# EAGLE design WS2812 (EAGLE 6.3)
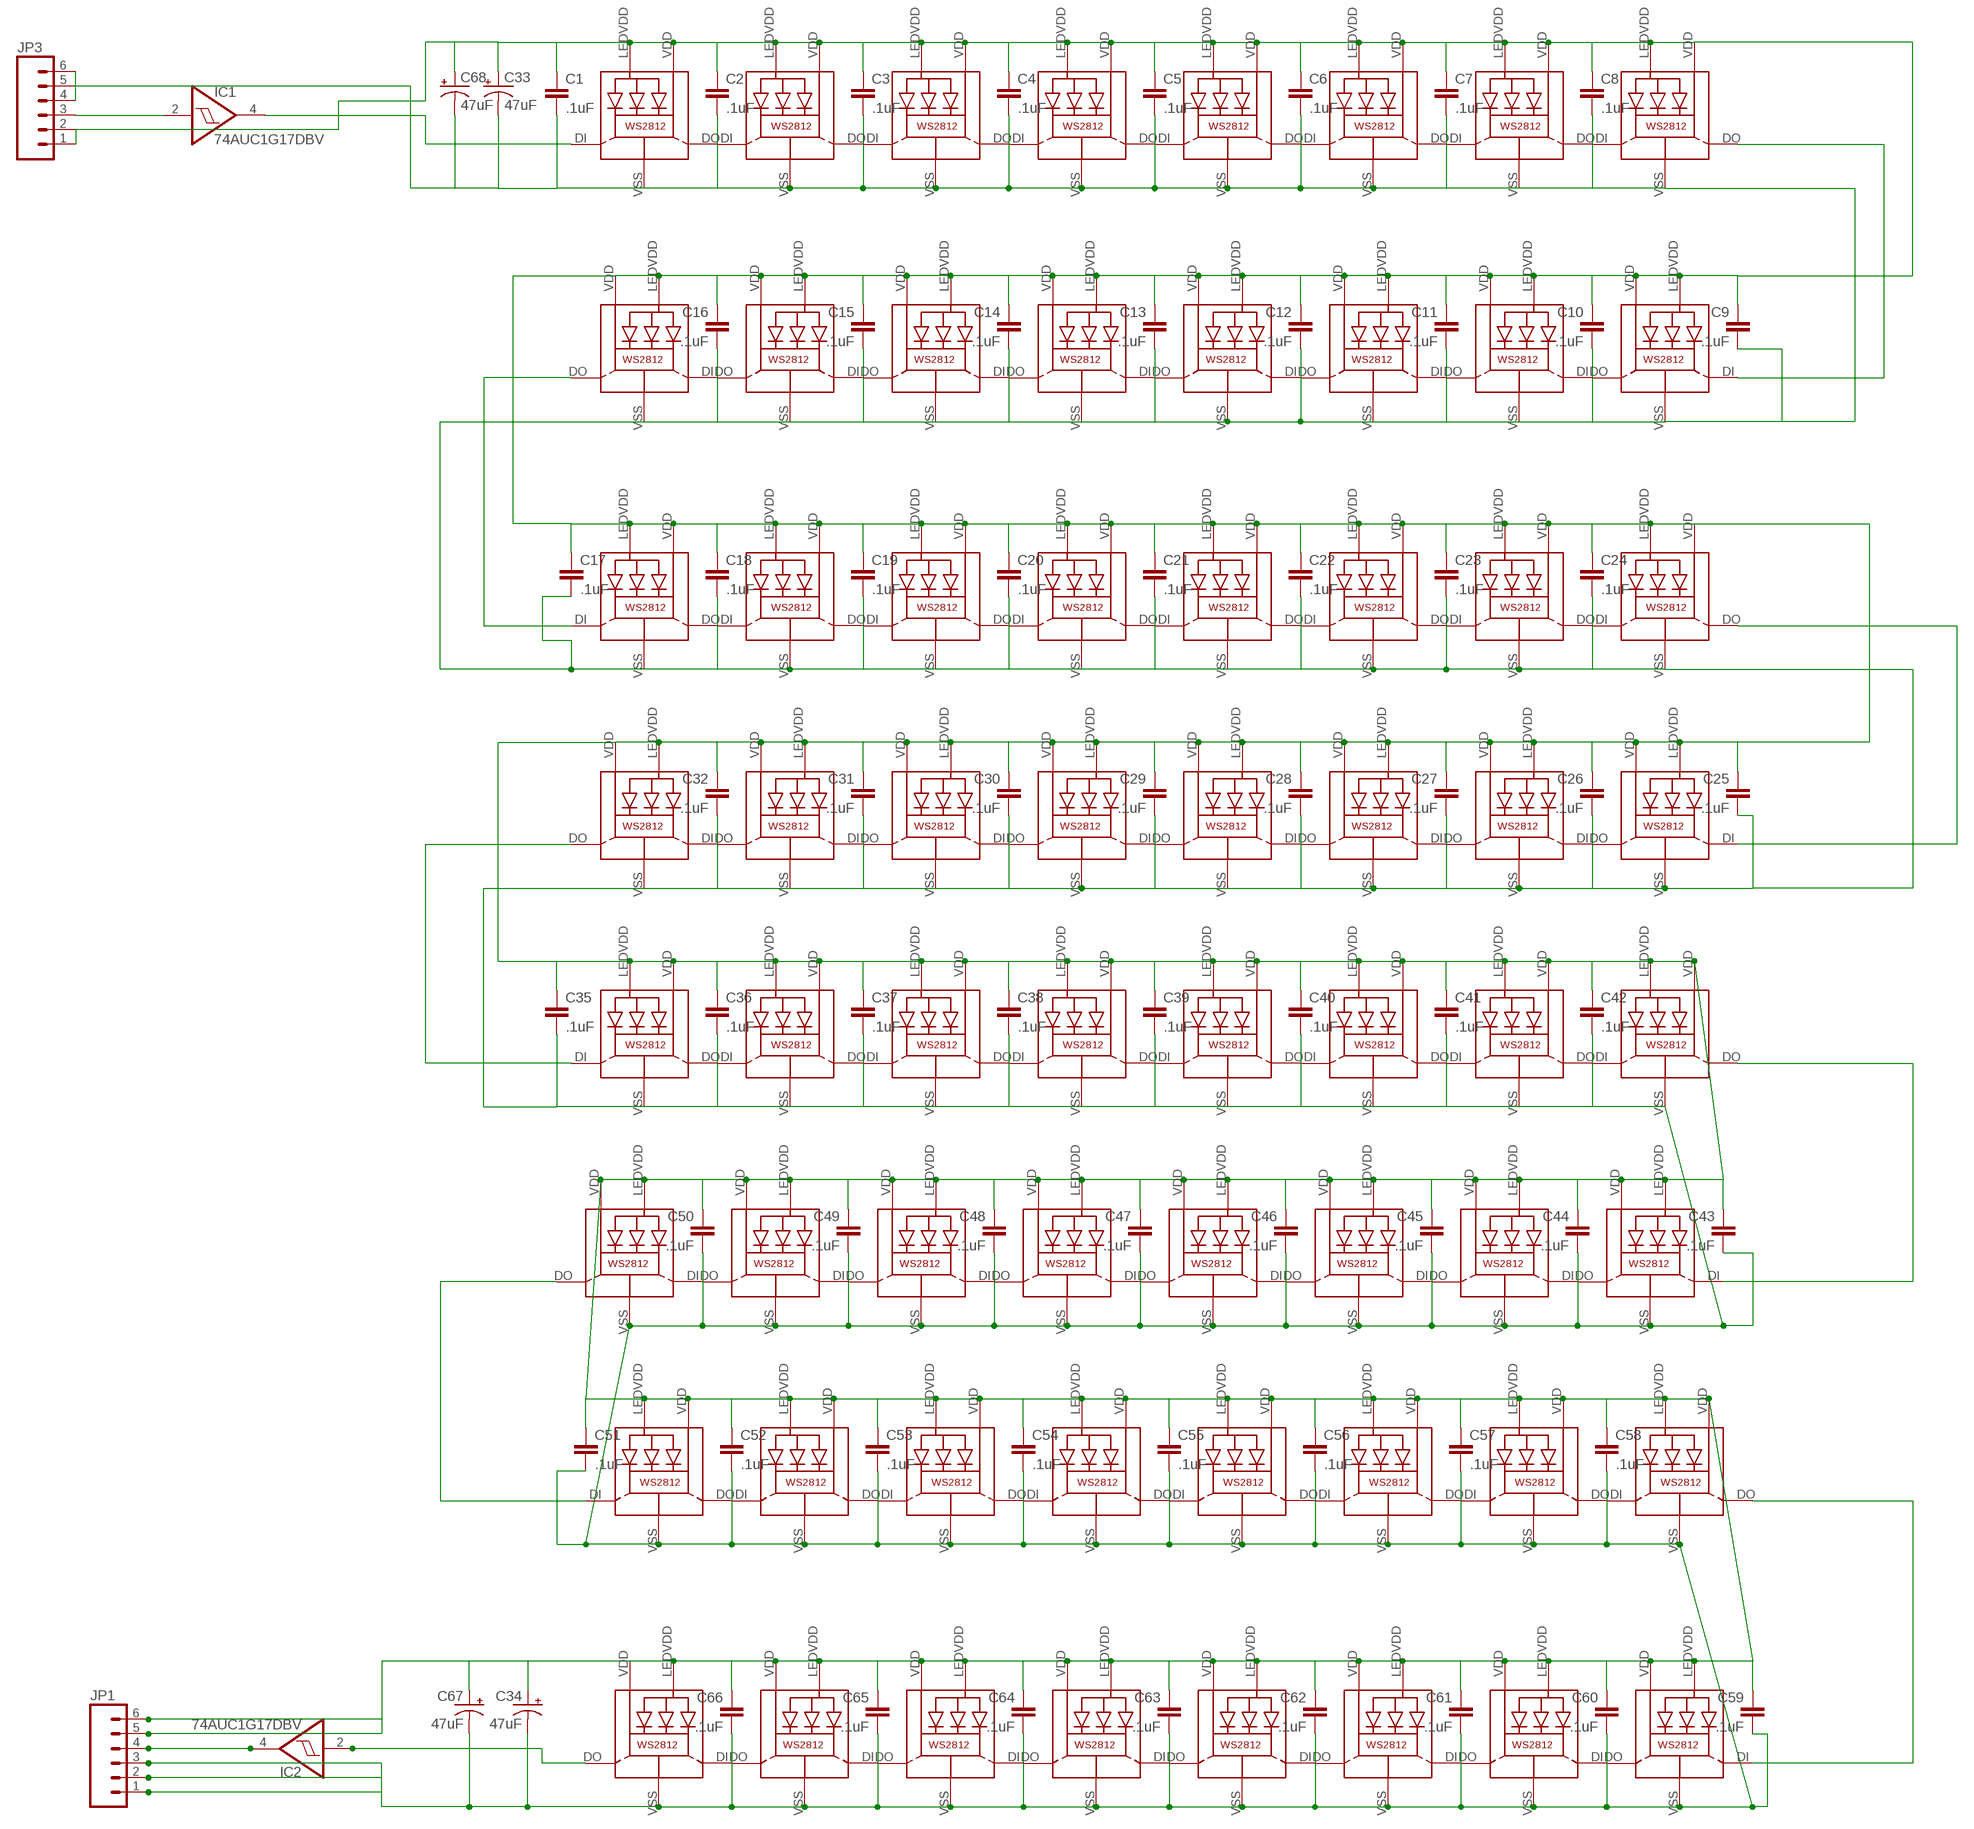
[diagram p0: schematic, sheet 1]

## Parts
C1  .1uF  CAP0603-CAP  [0603-CAP]
C2  .1uF  CAP0603-CAP  [0603-CAP]
C3  .1uF  CAP0603-CAP  [0603-CAP]
C4  .1uF  CAP0603-CAP  [0603-CAP]
C5  .1uF  CAP0603-CAP  [0603-CAP]
C6  .1uF  CAP0603-CAP  [0603-CAP]
C7  .1uF  CAP0603-CAP  [0603-CAP]
C8  .1uF  CAP0603-CAP  [0603-CAP]
C9  .1uF  CAP0603-CAP  [0603-CAP]
C10  .1uF  CAP0603-CAP  [0603-CAP]
C11  .1uF  CAP0603-CAP  [0603-CAP]
C12  .1uF  CAP0603-CAP  [0603-CAP]
C13  .1uF  CAP0603-CAP  [0603-CAP]
C14  .1uF  CAP0603-CAP  [0603-CAP]
C15  .1uF  CAP0603-CAP  [0603-CAP]
C16  .1uF  CAP0603-CAP  [0603-CAP]
C17  .1uF  CAP0603-CAP  [0603-CAP]
C18  .1uF  CAP0603-CAP  [0603-CAP]
C19  .1uF  CAP0603-CAP  [0603-CAP]
C20  .1uF  CAP0603-CAP  [0603-CAP]
C21  .1uF  CAP0603-CAP  [0603-CAP]
C22  .1uF  CAP0603-CAP  [0603-CAP]
C23  .1uF  CAP0603-CAP  [0603-CAP]
C24  .1uF  CAP0603-CAP  [0603-CAP]
C25  .1uF  CAP0603-CAP  [0603-CAP]
C26  .1uF  CAP0603-CAP  [0603-CAP]
C27  .1uF  CAP0603-CAP  [0603-CAP]
C28  .1uF  CAP0603-CAP  [0603-CAP]
C29  .1uF  CAP0603-CAP  [0603-CAP]
C30  .1uF  CAP0603-CAP  [0603-CAP]
C31  .1uF  CAP0603-CAP  [0603-CAP]
C32  .1uF  CAP0603-CAP  [0603-CAP]
C33  47uF  CAP_POL1206  [EIA3216]
C34  47uF  CAP_POL1206  [EIA3216]
C35  .1uF  CAP0603-CAP  [0603-CAP]
C36  .1uF  CAP0603-CAP  [0603-CAP]
C37  .1uF  CAP0603-CAP  [0603-CAP]
C38  .1uF  CAP0603-CAP  [0603-CAP]
C39  .1uF  CAP0603-CAP  [0603-CAP]
C40  .1uF  CAP0603-CAP  [0603-CAP]
C41  .1uF  CAP0603-CAP  [0603-CAP]
C42  .1uF  CAP0603-CAP  [0603-CAP]
C43  .1uF  CAP0603-CAP  [0603-CAP]
C44  .1uF  CAP0603-CAP  [0603-CAP]
C45  .1uF  CAP0603-CAP  [0603-CAP]
C46  .1uF  CAP0603-CAP  [0603-CAP]
C47  .1uF  CAP0603-CAP  [0603-CAP]
C48  .1uF  CAP0603-CAP  [0603-CAP]
C49  .1uF  CAP0603-CAP  [0603-CAP]
C50  .1uF  CAP0603-CAP  [0603-CAP]
C51  .1uF  CAP0603-CAP  [0603-CAP]
C52  .1uF  CAP0603-CAP  [0603-CAP]
C53  .1uF  CAP0603-CAP  [0603-CAP]
C54  .1uF  CAP0603-CAP  [0603-CAP]
C55  .1uF  CAP0603-CAP  [0603-CAP]
C56  .1uF  CAP0603-CAP  [0603-CAP]
C57  .1uF  CAP0603-CAP  [0603-CAP]
C58  .1uF  CAP0603-CAP  [0603-CAP]
C59  .1uF  CAP0603-CAP  [0603-CAP]
C60  .1uF  CAP0603-CAP  [0603-CAP]
C61  .1uF  CAP0603-CAP  [0603-CAP]
C62  .1uF  CAP0603-CAP  [0603-CAP]
C63  .1uF  CAP0603-CAP  [0603-CAP]
C64  .1uF  CAP0603-CAP  [0603-CAP]
C65  .1uF  CAP0603-CAP  [0603-CAP]
C66  .1uF  CAP0603-CAP  [0603-CAP]
C67  47uF  CAP_POL1206  [EIA3216]
C68  47uF  CAP_POL1206  [EIA3216]
IC1  74AUC1G17DBV  [SOT23-5]
IC2  74AUC1G17DBV  [SOT23-5]
JP1  M06SMD  [1X06-SMD]
JP3  M06SMD  [1X06-SMD]
LED1  WS2812  [WS2812]
LED2  WS2812  [WS2812]
LED3  WS2812  [WS2812]
LED4  WS2812  [WS2812]
LED5  WS2812  [WS2812]
LED6  WS2812  [WS2812]
LED7  WS2812  [WS2812]
LED8  WS2812  [WS2812]
LED9  WS2812  [WS2812]
LED10  WS2812  [WS2812]
LED11  WS2812  [WS2812]
LED12  WS2812  [WS2812]
LED13  WS2812  [WS2812]
LED14  WS2812  [WS2812]
LED15  WS2812  [WS2812]
LED16  WS2812  [WS2812]
LED17  WS2812  [WS2812]
LED18  WS2812  [WS2812]
LED19  WS2812  [WS2812]
LED20  WS2812  [WS2812]
LED21  WS2812  [WS2812]
LED22  WS2812  [WS2812]
LED23  WS2812  [WS2812]
LED24  WS2812  [WS2812]
LED25  WS2812  [WS2812]
LED26  WS2812  [WS2812]
LED27  WS2812  [WS2812]
LED28  WS2812  [WS2812]
LED29  WS2812  [WS2812]
LED30  WS2812  [WS2812]
LED31  WS2812  [WS2812]
LED32  WS2812  [WS2812]
LED33  WS2812  [WS2812]
LED34  WS2812  [WS2812]
LED35  WS2812  [WS2812]
LED36  WS2812  [WS2812]
LED37  WS2812  [WS2812]
LED38  WS2812  [WS2812]
LED39  WS2812  [WS2812]
LED40  WS2812  [WS2812]
LED41  WS2812  [WS2812]
LED42  WS2812  [WS2812]
LED43  WS2812  [WS2812]
LED44  WS2812  [WS2812]
LED45  WS2812  [WS2812]
LED46  WS2812  [WS2812]
LED47  WS2812  [WS2812]
LED48  WS2812  [WS2812]
LED49  WS2812  [WS2812]
LED50  WS2812  [WS2812]
LED51  WS2812  [WS2812]
LED52  WS2812  [WS2812]
LED53  WS2812  [WS2812]
LED54  WS2812  [WS2812]
LED55  WS2812  [WS2812]
LED56  WS2812  [WS2812]
LED57  WS2812  [WS2812]
LED58  WS2812  [WS2812]
LED59  WS2812  [WS2812]
LED60  WS2812  [WS2812]
LED61  WS2812  [WS2812]
LED62  WS2812  [WS2812]
LED63  WS2812  [WS2812]
LED64  WS2812  [WS2812]

## Nets
DIN: IC1.4(O) LED1.DI
DIN1: LED32.DO LED33.DI
DIN_B: IC1.2(I) JP3.3
DO: IC2.4(O) JP1.4
DO_B: IC2.2(I) LED64.DO
GND: C1.2 C2.2 C3.2 C4.2 C5.2 C6.2 C7.2 C8.2 C9.2 C10.2 C11.2 C12.2 C13.2 C14.2 C15.2 C16.2 C17.2 C18.2 C19.2 C20.2 C21.2 C22.2 C23.2 C24.2 C25.2 C26.2 C27.2 C28.2 C29.2 C30.2 C31.2 C32.2 C33.C(-) C34.C(-) C35.2 C36.2 C37.2 C38.2 C39.2 C40.2 C41.2 C42.2 C43.2 C44.2 C45.2 C46.2 C47.2 C48.2 C49.2 C50.2 C51.2 C52.2 C53.2 C54.2 C55.2 C56.2 C57.2 C58.2 C59.2 C60.2 C61.2 C62.2 C63.2 C64.2 C65.2 C66.2 C67.C(-) C68.C(-) JP1.1 JP1.2 JP1.3 JP3.4 JP3.5 JP3.6 LED1.VSS(GND) LED2.VSS(GND) LED3.VSS(GND) LED4.VSS(GND) LED5.VSS(GND) LED6.VSS(GND) LED7.VSS(GND) LED8.VSS(GND) LED9.VSS(GND) LED10.VSS(GND) LED11.VSS(GND) LED12.VSS(GND) LED13.VSS(GND) LED14.VSS(GND) LED15.VSS(GND) LED16.VSS(GND) LED17.VSS(GND) LED18.VSS(GND) LED19.VSS(GND) LED20.VSS(GND) LED21.VSS(GND) LED22.VSS(GND) LED23.VSS(GND) LED24.VSS(GND) LED25.VSS(GND) LED26.VSS(GND) LED27.VSS(GND) LED28.VSS(GND) LED29.VSS(GND) LED30.VSS(GND) LED31.VSS(GND) LED32.VSS(GND) LED33.VSS(GND) LED34.VSS(GND) LED35.VSS(GND) LED36.VSS(GND) LED37.VSS(GND) LED38.VSS(GND) LED39.VSS(GND) LED40.VSS(GND) LED41.VSS(GND) LED42.VSS(GND) LED43.VSS(GND) LED44.VSS(GND) LED45.VSS(GND) LED46.VSS(GND) LED47.VSS(GND) LED48.VSS(GND) LED49.VSS(GND) LED50.VSS(GND) LED51.VSS(GND) LED52.VSS(GND) LED53.VSS(GND) LED54.VSS(GND) LED55.VSS(GND) LED56.VSS(GND) LED57.VSS(GND) LED58.VSS(GND) LED59.VSS(GND) LED60.VSS(GND) LED61.VSS(GND) LED62.VSS(GND) LED63.VSS(GND) LED64.VSS(GND)
N$1: LED1.DO LED2.DI
N$2: LED2.DO LED3.DI
N$3: LED3.DO LED4.DI
N$4: LED5.DO LED6.DI
N$5: LED6.DO LED7.DI
N$6: LED7.DO LED8.DI
N$7: LED9.DO LED10.DI
N$8: LED10.DO LED11.DI
N$9: LED11.DO LED12.DI
N$10: LED13.DO LED14.DI
N$11: LED14.DO LED15.DI
N$12: LED15.DO LED16.DI
N$13: LED17.DO LED18.DI
N$14: LED18.DO LED19.DI
N$15: LED19.DO LED20.DI
N$16: LED21.DO LED22.DI
N$17: LED22.DO LED23.DI
N$18: LED23.DO LED24.DI
N$19: LED25.DO LED26.DI
N$20: LED26.DO LED27.DI
N$21: LED27.DO LED28.DI
N$22: LED29.DO LED30.DI
N$23: LED30.DO LED31.DI
N$24: LED31.DO LED32.DI
N$26: LED4.DO LED5.DI
N$27: LED16.DO LED17.DI
N$28: LED33.DO LED34.DI
N$29: LED34.DO LED35.DI
N$30: LED35.DO LED36.DI
N$31: LED37.DO LED38.DI
N$32: LED38.DO LED39.DI
N$33: LED39.DO LED40.DI
N$34: LED41.DO LED42.DI
N$35: LED42.DO LED43.DI
N$36: LED43.DO LED44.DI
N$37: LED45.DO LED46.DI
N$38: LED46.DO LED47.DI
N$39: LED47.DO LED48.DI
N$40: LED49.DO LED50.DI
N$41: LED50.DO LED51.DI
N$42: LED51.DO LED52.DI
N$43: LED53.DO LED54.DI
N$44: LED54.DO LED55.DI
N$45: LED55.DO LED56.DI
N$46: LED57.DO LED58.DI
N$47: LED58.DO LED59.DI
N$48: LED59.DO LED60.DI
N$49: LED61.DO LED62.DI
N$50: LED62.DO LED63.DI
N$51: LED63.DO LED64.DI
N$52: LED12.DO LED13.DI
N$53: LED20.DO LED21.DI
N$54: LED44.DO LED45.DI
N$55: LED52.DO LED53.DI
N$56: LED28.DO LED29.DI
N$57: LED8.DO LED9.DI
N$58: LED40.DO LED41.DI
N$59: LED24.DO LED25.DI
N$60: LED36.DO LED37.DI
N$61: LED60.DO LED61.DI
N$62: LED48.DO LED49.DI
N$63: LED56.DO LED57.DI
VDD: C1.1 C2.1 C3.1 C4.1 C5.1 C6.1 C7.1 C8.1 C9.1 C10.1 C11.1 C12.1 C13.1 C14.1 C15.1 C16.1 C17.1 C18.1 C19.1 C20.1 C21.1 C22.1 C23.1 C24.1 C25.1 C26.1 C27.1 C28.1 C29.1 C30.1 C31.1 C32.1 C33.A(+) C34.A(+) C35.1 C36.1 C37.1 C38.1 C39.1 C40.1 C41.1 C42.1 C43.1 C44.1 C45.1 C46.1 C47.1 C48.1 C49.1 C50.1 C51.1 C52.1 C53.1 C54.1 C55.1 C56.1 C57.1 C58.1 C59.1 C60.1 C61.1 C62.1 C63.1 C64.1 C65.1 C66.1 C67.A(+) C68.A(+) JP1.5 JP1.6 JP3.1 JP3.2 LED1.LEDVDD LED1.VDD LED2.LEDVDD LED2.VDD LED3.LEDVDD LED3.VDD LED4.LEDVDD LED4.VDD LED5.LEDVDD LED5.VDD LED6.LEDVDD LED6.VDD LED7.LEDVDD LED7.VDD LED8.LEDVDD LED8.VDD LED9.LEDVDD LED9.VDD LED10.LEDVDD LED10.VDD LED11.LEDVDD LED11.VDD LED12.LEDVDD LED12.VDD LED13.LEDVDD LED13.VDD LED14.LEDVDD LED14.VDD LED15.LEDVDD LED15.VDD LED16.LEDVDD LED16.VDD LED17.LEDVDD LED17.VDD LED18.LEDVDD LED18.VDD LED19.LEDVDD LED19.VDD LED20.LEDVDD LED20.VDD LED21.LEDVDD LED21.VDD LED22.LEDVDD LED22.VDD LED23.LEDVDD LED23.VDD LED24.LEDVDD LED24.VDD LED25.LEDVDD LED25.VDD LED26.LEDVDD LED26.VDD LED27.LEDVDD LED27.VDD LED28.LEDVDD LED28.VDD LED29.LEDVDD LED29.VDD LED30.LEDVDD LED30.VDD LED31.LEDVDD LED31.VDD LED32.LEDVDD LED32.VDD LED33.LEDVDD LED33.VDD LED34.LEDVDD LED34.VDD LED35.LEDVDD LED35.VDD LED36.LEDVDD LED36.VDD LED37.LEDVDD LED37.VDD LED38.LEDVDD LED38.VDD LED39.LEDVDD LED39.VDD LED40.LEDVDD LED40.VDD LED41.LEDVDD LED41.VDD LED42.LEDVDD LED42.VDD LED43.LEDVDD LED43.VDD LED44.LEDVDD LED44.VDD LED45.LEDVDD LED45.VDD LED46.LEDVDD LED46.VDD LED47.LEDVDD LED47.VDD LED48.LEDVDD LED48.VDD LED49.LEDVDD LED49.VDD LED50.LEDVDD LED50.VDD LED51.LEDVDD LED51.VDD LED52.LEDVDD LED52.VDD LED53.LEDVDD LED53.VDD LED54.LEDVDD LED54.VDD LED55.LEDVDD LED55.VDD LED56.LEDVDD LED56.VDD LED57.LEDVDD LED57.VDD LED58.LEDVDD LED58.VDD LED59.LEDVDD LED59.VDD LED60.LEDVDD LED60.VDD LED61.LEDVDD LED61.VDD LED62.LEDVDD LED62.VDD LED63.LEDVDD LED63.VDD LED64.LEDVDD LED64.VDD

## Power pins joined to a net without a drawn wire
GND: IC1.3(GND) IC2.3(GND)
VDD: IC1.5(VCC) IC2.5(VCC)

## Library data of the parts
C1-C32 C35-C66 = 1x05smd:CAP: Capacitor Standard 0603 ceramic capacitor, and 0.1" leaded capacitor.
C33 C34 C67 C68 = SparkFun-Capacitors:CAP_POL: Capacitor Polarized These are standard SMD and PTH capacitors. Normally 10uF, 47uF, and 100uF in electrolytic and tantalum varieties. Always verify the external diameter of the through hole cap, it varies with capacity, voltage, and manufacturer. The EIA devices should be standard.
IC1 IC2 = 74xx-little-de:74*1G17: Single Schmitt-Trigger Buffer
JP1 JP3 = 1x05smd:M06: Header 6 Standard 6-pin 0.1" header. Use with straight break away headers (SKU : PRT-00116), right angle break away headers (PRT-00553), swiss pins (PRT-00743), machine pins (PRT-00117), and female headers (PRT-00115). Molex polarized connector foot print use with SKU : PRT-08094 with associated crimp pins and housings. NOTES ON THE VARIANTS LOCK and LOCK_LONGPADS... This footprint was designed to help hold the alignment of a through-hole component (i.e. 6-pin header) while soldering it into place. You may notice that each hole has been shifted either up or down by 0.005 of an inch from it's more standard position (which is a perfectly straight line). This slight alteration caused the pins (the squares in the middle) to touch the edges of the holes. Because they are alternating, it causes a "brace" to hold the component in place. 0.005 has proven to be the perfect amount of "off-center" position when using our standard breakaway headers. Although looks a little odd when you look at the bare footprint, once you have a header in there, the alteration is very hard to notice. Also, if you push a header all the way into place, it is covered up entirely on the bottom side. This idea of altering the position of holes to aid alignment will be further integrated into the Sparkfun Library for other footprints. It can help hold any component with 3 or more connection pins.
LED1-LED64 = adafruit:WS2812

## Board
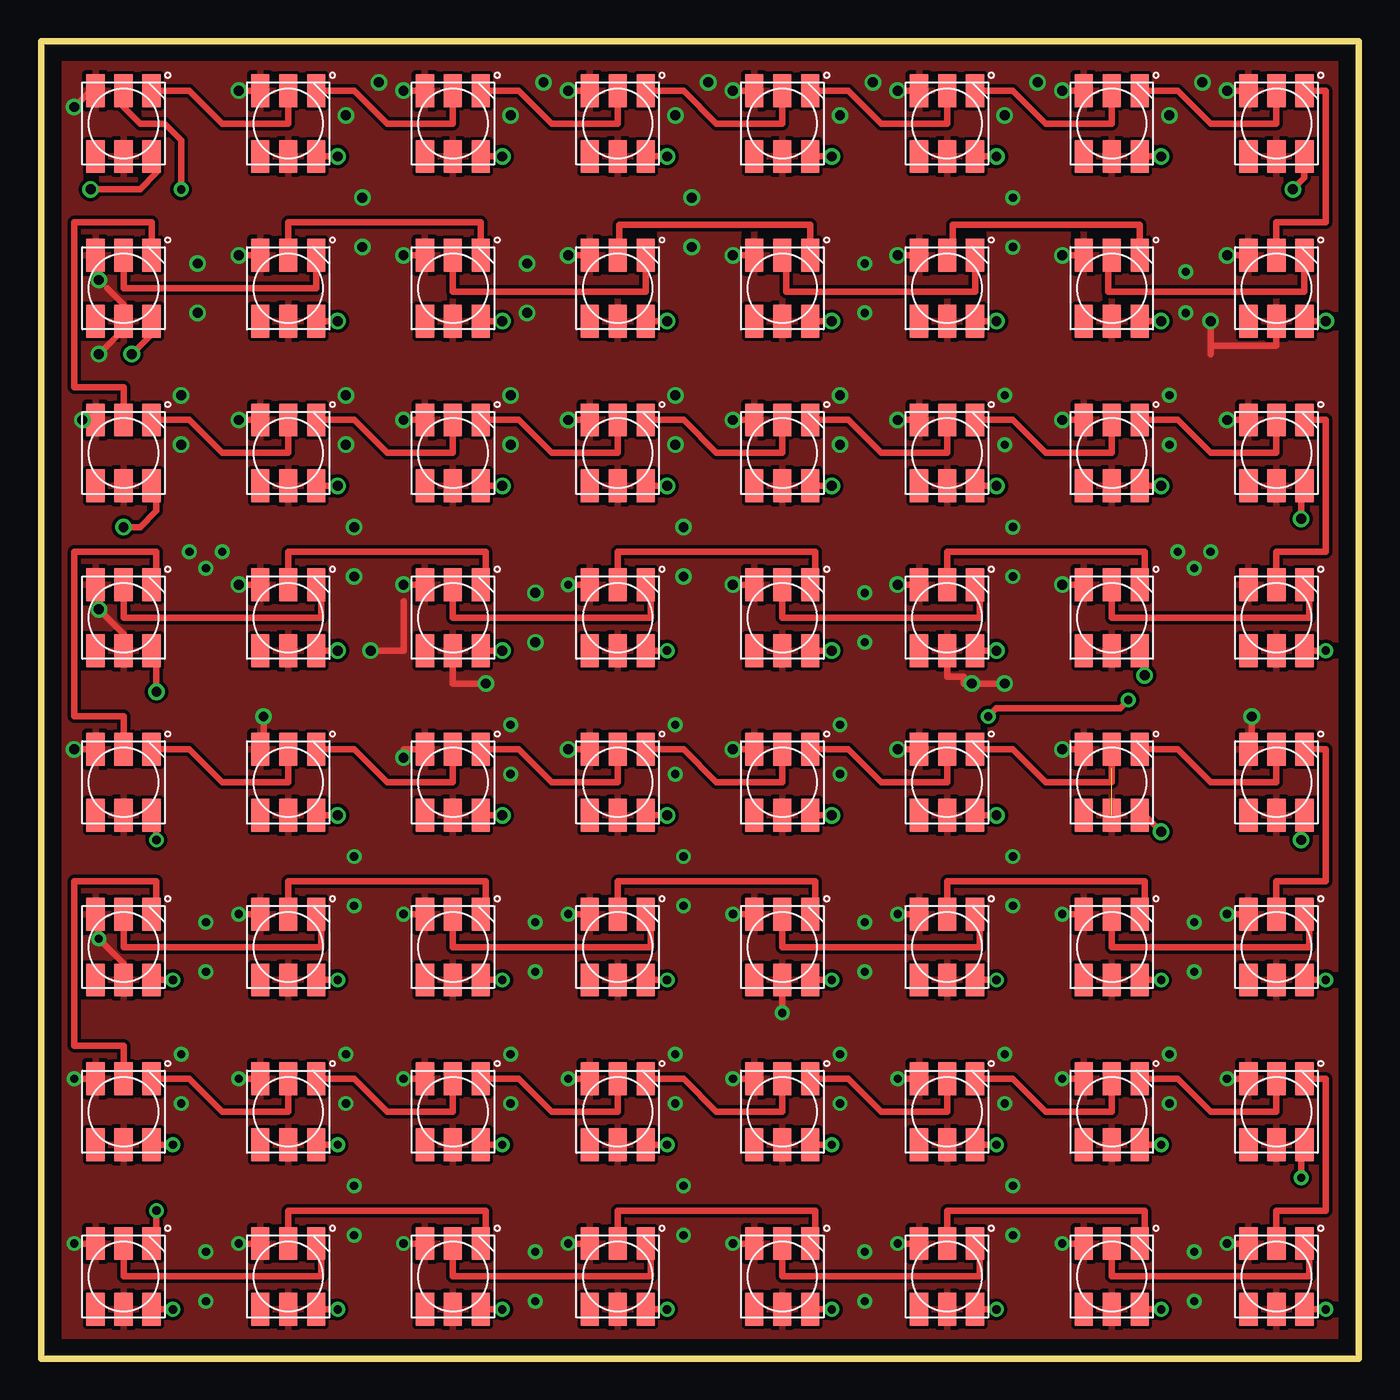
[diagram p1: board, top side]
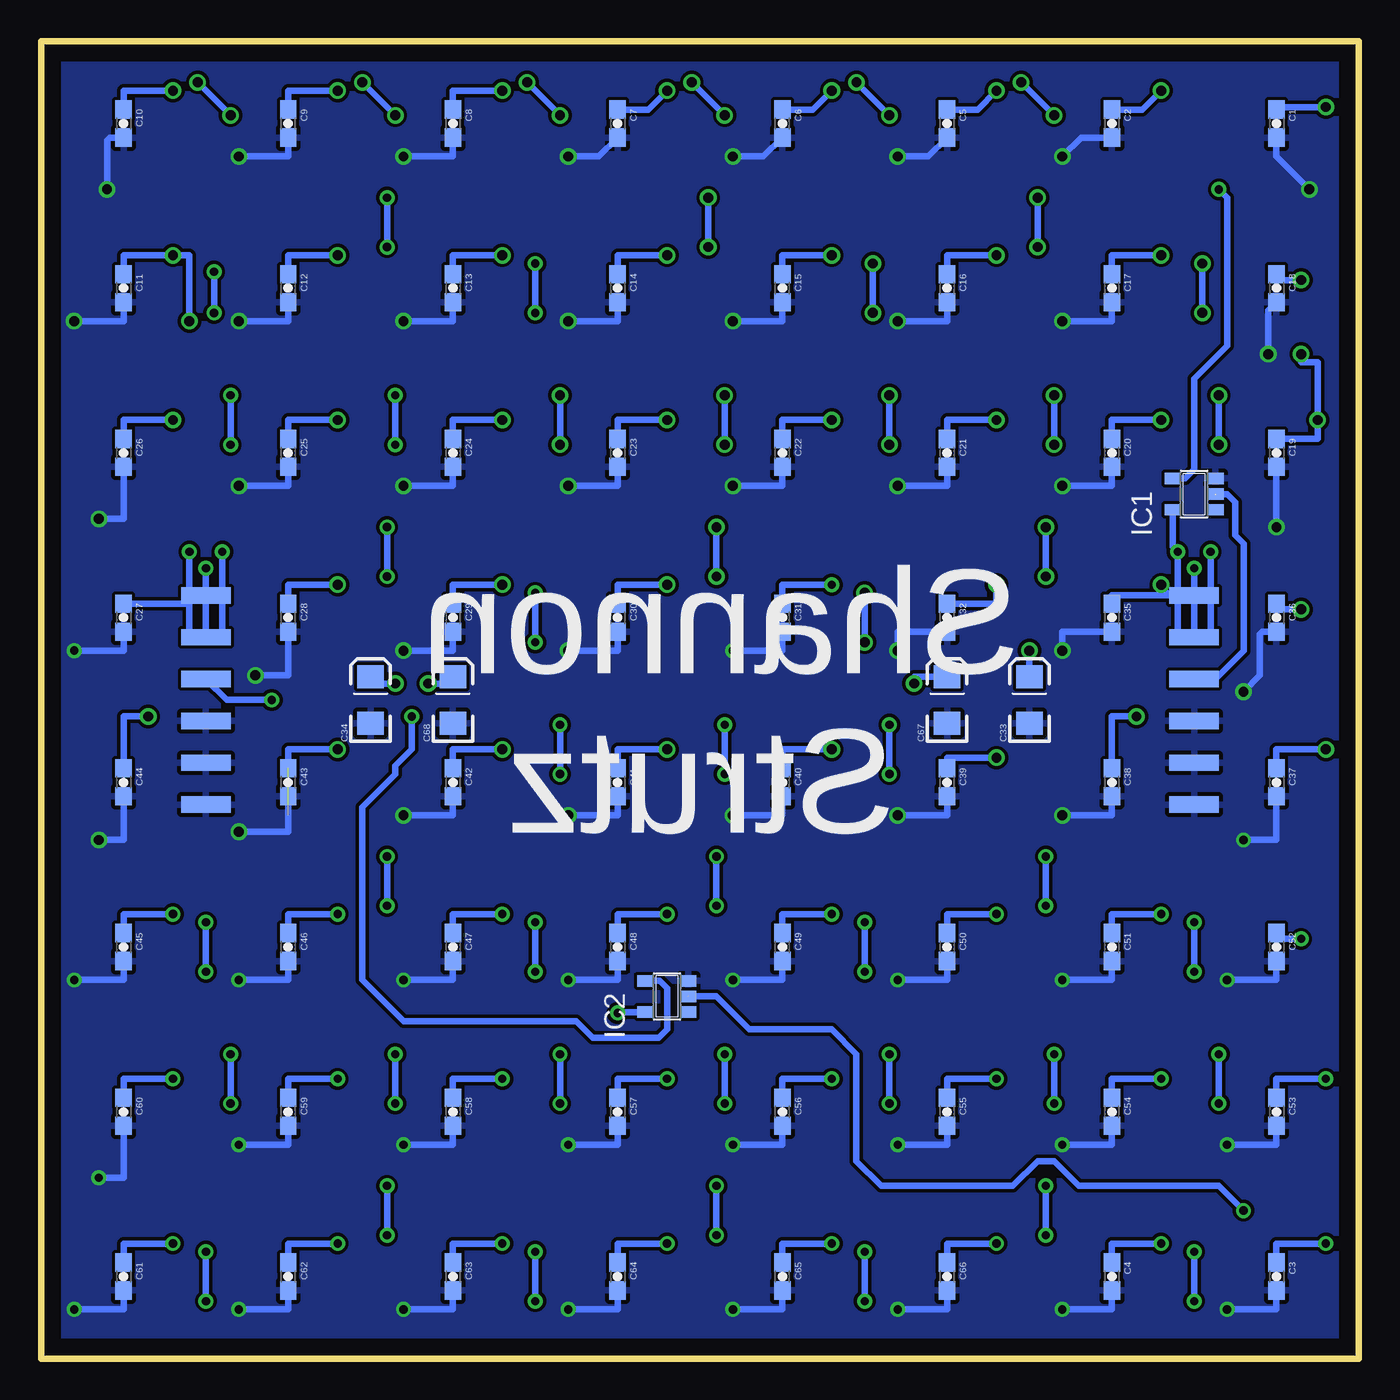
[diagram p2: board, bottom side, seen from below]

Size 80 x 80 mm. Coordinates in mm from the lower left corner, seen from the top.
Outline: 0,0 80,0 80,80 0,80 0,0
Copper layers (1*16): Top 0.035mm / dielectric 1.5mm / Bottom 0.035mm
Design rules "default": minimum track width 10mil, minimum drill 24mil, track to track 8mil, track to pad 8mil, pad to pad 8mil, via to via 8mil, smd to smd 8mil, copper to edge 40mil, drill to drill 8mil, minimum pad ring 10mil, minimum via ring 8mil, stop-mask expansion 4mil, vias tented up to drill 0mil, thermal gap 10mil

### Footprints (pad centres in the part's own frame; a part is rotated, then mirrored left to right if it is on the bottom)
0603-CAP = smd 1.1 x 1: 1 -0.85,0; 2 0.85,0
EIA3216 = smd 1.4 x 1.6: A 1.4,0; C -1.4,0
SOT23-5 = smd 0.69 x 0.99: 1 -0.95,-1.29; 2 0,-1.29; 3 0.95,-1.29; 4 0.95,1.3; 5 -0.95,1.3
1X06-SMD = smd 1 x 3: 1 -6.35,5; 2 -3.81,5; 3 -1.27,5; 4 1.27,5; 5 3.81,5; 6 6.35,5
WS2812 = smd 2 x 1.1: DI 2,0; DO 2,-1.7; LEDVDD -2,0; NC -2,1.7; VDD 2,1.7; VSS -2,-1.7

### Placement (x,y rotation side)
C1  5,75 270 bottom
C2  15,75 270 bottom
C3  5,5 270 bottom
C4  15,5 270 bottom
C5  25,75 270 bottom
C6  35,75 270 bottom
C7  45,75 270 bottom
C8  55,75 270 bottom
C9  65,75 270 bottom
C10  75,75 270 bottom
C11  75,65 270 bottom
C12  65,65 270 bottom
C13  55,65 270 bottom
C14  45,65 270 bottom
C15  35,65 270 bottom
C16  25,65 270 bottom
C17  15,65 270 bottom
C18  5,65 270 bottom
C19  5,55 270 bottom
C20  15,55 270 bottom
C21  25,55 270 bottom
C22  35,55 270 bottom
C23  45,55 270 bottom
C24  55,55 270 bottom
C25  65,55 270 bottom
C26  75,55 270 bottom
C27  75,45 270 bottom
C28  65,45 270 bottom
C29  55,45 270 bottom
C30  45,45 270 bottom
C31  35,45 270 bottom
C32  25,45 270 bottom
C33  20,40 90 bottom
C34  60,40 90 bottom
C35  15,45 270 bottom
C36  5,45 270 bottom
C37  5,35 270 bottom
C38  15,35 270 bottom
C39  25,35 270 bottom
C40  35,35 270 bottom
C41  45,35 270 bottom
C42  55,35 270 bottom
C43  65,35 270 bottom
C44  75,35 270 bottom
C45  75,25 270 bottom
C46  65,25 270 bottom
C47  55,25 270 bottom
C48  45,25 270 bottom
C49  35,25 270 bottom
C50  25,25 270 bottom
C51  15,25 270 bottom
C52  5,25 270 bottom
C53  5,15 270 bottom
C54  15,15 270 bottom
C55  25,15 270 bottom
C56  35,15 270 bottom
C57  45,15 270 bottom
C58  55,15 270 bottom
C59  65,15 270 bottom
C60  75,15 270 bottom
C61  75,5 270 bottom
C62  65,5 270 bottom
C63  55,5 270 bottom
C64  45,5 270 bottom
C65  35,5 270 bottom
C66  25,5 270 bottom
C67  25,40 90 bottom
C68  55,40 90 bottom
IC1  10,52.5 90 bottom
IC2  42,22 90 bottom
JP1  65,40 90 bottom
JP3  15,40 270 bottom
LED1  5,75 90 top
LED2  15,75 90 top
LED3  25,75 90 top
LED4  35,75 90 top
LED5  45,75 90 top
LED6  55,75 90 top
LED7  65,75 90 top
LED8  75,75 90 top
LED9  75,65 90 top
LED10  65,65 90 top
LED11  55,65 90 top
LED12  45,65 90 top
LED13  35,65 90 top
LED14  25,65 90 top
LED15  15,65 90 top
LED16  5,65 90 top
LED17  5,55 90 top
LED18  15,55 90 top
LED19  25,55 90 top
LED20  35,55 90 top
LED21  45,55 90 top
LED22  55,55 90 top
LED23  65,55 90 top
LED24  75,55 90 top
LED25  75,45 90 top
LED26  65,45 90 top
LED27  55,45 90 top
LED28  45,45 90 top
LED29  35,45 90 top
LED30  25,45 90 top
LED31  15,45 90 top
LED32  5,45 90 top
LED33  5,35 90 top
LED34  15,35 90 top
LED35  25,35 90 top
LED36  35,35 90 top
LED37  45,35 90 top
LED38  55,35 90 top
LED39  65,35 90 top
LED40  75,35 90 top
LED41  75,25 90 top
LED42  65,25 90 top
LED43  55,25 90 top
LED44  45,25 90 top
LED45  35,25 90 top
LED46  25,25 90 top
LED47  15,25 90 top
LED48  5,25 90 top
LED49  5,15 90 top
LED50  15,15 90 top
LED51  25,15 90 top
LED52  35,15 90 top
LED53  45,15 90 top
LED54  55,15 90 top
LED55  65,15 90 top
LED56  75,15 90 top
LED57  75,5 90 top
LED58  65,5 90 top
LED59  55,5 90 top
LED60  45,5 90 top
LED61  35,5 90 top
LED62  25,5 90 top
LED63  15,5 90 top
LED64  5,5 90 top

### Tracks (layer width: path | path; a pad name or v marks a point on that pad's centre or on a via)
DIN  (via drill 0.5 pad 0.25)
  Top 0.406: v8.5,71 8.5,74 7.5,75 6,75 5,76 LED1.DI
  Bottom 0.406: IC1.4 10.55,53.45 10,54 10,59.5 8,61.5 8,70.5 v8.5,71
DIN1
  Top 0.406: LED32.DO 7,47 7,49 2,49 2,39 5,39 LED33.DI
DIN_B
  Bottom 0.406: JP3.3 8.73,41.27 7,43 7,49.5 7.5,50 7.5,52 8,52.5 IC1.2
DO  (via drill 0.5 pad 0.25)
  Top 0.406: v57.5,39 58,39.5 65.5,39.5 v66,40
  Bottom 0.406: IC2.4 42.45,22.95 42,22.5 42,20 42.5,19.5 46.5,19.5 47.5,20.5 58,20.5 60.5,23 60.5,33.5 58.5,35.5 58.5,36 57.5,37 v57.5,39 | v66,40 68.73,40 JP1.4
DO_B  (via drill 0.5 pad 0.25)
  Top 0.406: v7,9 7,7.3 LED64.DO
  Bottom 0.406: IC2.2 39,22 37,20 32,20 30.5,18.5 30.5,12 29,10.5 21,10.5 19.5,12 18.5,12 17,10.5 8.5,10.5 v7,9
GND  (via drill 0.5 pad 0.25, 0.6)
  Top 0.406: v28,43 LED30.VSS | v18,43 LED31.VSS | v3,71 6,71 7,72 7,72.7 LED1.VSS | v18,73 LED2.VSS | LED3.VSS v28,73 | LED4.VSS v38,73 | LED5.VSS v48,73 | LED6.VSS v58,73 | LED7.VSS v68,73 | LED8.VSS 76.7,71.7 v76,71 | LED16.VSS 6.7,62.2 v5.5,61 | LED15.VSS v18,63 | LED14.VSS v28,63 | LED13.VSS v38,63 | LED12.VSS v48,63 | LED11.VSS v58,63 | LED10.VSS v68,63 | LED9.VSS v78,63 | LED24.VSS 76.5,53 v76.5,51 | LED23.VSS v68,53 | LED22.VSS v58,53 | LED21.VSS v48,53 | LED20.VSS v38,53 | LED19.VSS v28,53 | LED18.VSS v18,53 | v5,50.5 6,50.5 7,51.5 7,52.7 LED17.VSS | v7,40.5 7,42.7 LED32.VSS | LED34.VSS v18,33 | LED35.VSS v28,33 | LED36.VSS v38,33 | LED37.VSS v48,33 | LED38.VSS v58,33 | LED39.VSS 67,33 v68,32 | LED40.VSS 76.5,33 v76.5,31.5 | LED28.VSS v48,43 | LED27.VSS v58,43 | LED26.VSS 67,43 v67,41.5 | LED29.VSS v38,43 | LED25.VSS v78,43 | LED33.VSS 7,33 v7,31.5 | LED46.VSS v28,23 | LED47.VSS v18,23 | LED48.VSS v8,23 | LED45.VSS v38,23 | LED44.VSS v48,23 | LED43.VSS v58,23 | LED42.VSS v68,23 | LED41.VSS v78,23 | LED49.VSS v8,13 | LED50.VSS v18,13 | LED51.VSS v28,13 | LED52.VSS v38,13 | LED53.VSS v48,13 | LED54.VSS v58,13 | LED55.VSS v68,13 | LED56.VSS 76.5,13 v76.5,11 | LED64.VSS v8,3 | LED63.VSS v18,3 | LED62.VSS v28,3 | LED61.VSS v38,3 | LED59.VSS v58,3 | LED58.VSS v68,3 | LED57.VSS v78,3 | LED60.VSS v48,3
  Bottom 0.406: C32.2 28,44.15 v28,43 | C35.2 18,44.15 v18,43 | C1.2 5,73 v3,71 | C2.2 16.85,74.15 v18,73 | v28,73 26.15,73 C5.2 | v38,73 36.15,73 C6.2 | v48,73 46.15,73 C7.2 | v58,73 55,73 C8.2 | v68,73 65,73 C9.2 | v76,71 76,74 75.85,74.15 C10.2 | v5.5,61 5.5,63.65 C18.2 | v18,63 15,63 C17.2 | v28,63 25,63 C16.2 | v38,63 35,63 C15.2 | v48,63 45,63 C14.2 | v58,63 55,63 C13.2 | v68,63 65,63 C12.2 | v78,63 75,63 C11.2 | v76.5,51 75,51 C26.2 | v68,53 65,53 C25.2 | v58,53 55,53 C24.2 | v48,53 45,53 C23.2 | v38,53 35,53 C22.2 | v28,53 25,53 C21.2 | v18,53 15,53 C20.2 | C19.2 v5,50.5 | C36.2 5.85,44.15 6,44 6,41.5 v7,40.5 | v18,33 15,33 C38.2 | v28,33 25,33 C39.2 | v38,33 35,33 C40.2 | v48,33 45,33 C41.2 | v58,33 55,33 C42.2 | v68,32 65,32 C43.2 | v76.5,31.5 75,31.5 C44.2 | v48,43 45,43 C30.2 | v58,43 55,43 C29.2 | v67,41.5 65,41.5 C28.2 | v38,43 35,43 C31.2 | v78,43 75,43 C27.2 | v7,31.5 5,31.5 C37.2 | v28,23 25,23 C50.2 | v18,23 15,23 C51.2 | v8,23 5,23 C52.2 | v38,23 35,23 C49.2 | v48,23 45,23 C48.2 | v58,23 55,23 C47.2 | v68,23 65,23 C46.2 | v78,23 75,23 C45.2 | v8,13 5,13 C53.2 | v18,13 15,13 C54.2 | v28,13 25,13 C55.2 | v38,13 35,13 C56.2 | v48,13 45,13 C57.2 | v58,13 55,13 C58.2 | v68,13 65,13 C59.2 | v76.5,11 75,11 C60.2 | v8,3 5,3 C3.2 | v18,3 15,3 C4.2 | v28,3 25,3 C66.2 | v38,3 35,3 C65.2 | v58,3 55,3 C63.2 | v68,3 65,3 C62.2 | v78,3 75,3 C61.2 | v48,3 45,3 C64.2
  pour Bottom: 0,0 80,0 80,80 0,80
N$1
  Top 0.406: LED1.DO 9,77 11,75 15,75 LED2.DI
N$2
  Top 0.406: LED2.DO 19,77 21,75 25,75 LED3.DI
N$3
  Top 0.406: LED3.DO 29,77 31,75 35,75 LED4.DI
N$4
  Top 0.406: LED5.DO 49,77 51,75 55,75 LED6.DI
N$5
  Top 0.406: LED6.DO 59,77 61,75 65,75 LED7.DI
N$6
  Top 0.406: LED7.DO 69,77 71,75 75,75 LED8.DI
N$7
  Top 0.406: LED9.DO 76.7,64.8 64.8,64.8 64.8,67 LED10.DI
N$8
  Top 0.406: LED10.DO 66.7,68.85 55.35,68.85 55.35,67 LED11.DI
N$9
  Top 0.406: LED11.DO 56.7,64.8 45.23,64.8 45.23,67 LED12.DI
N$10
  Top 0.406: LED13.DO 36.7,64.8 24.98,64.8 24.98,67 LED14.DI
N$11
  Top 0.406: LED14.DO 26.7,69 15,69 LED15.DI
N$12
  Top 0.406: LED15.DO 16.7,65 5,65 LED16.DI
N$13
  Top 0.406: LED17.DO 9,57 11,55 15,55 LED18.DI
N$14
  Top 0.406: LED18.DO 19,57 21,55 25,55 LED19.DI
N$15
  Top 0.406: LED19.DO 29,57 31,55 35,55 LED20.DI
N$16
  Top 0.406: LED21.DO 49,57 51,55 55,55 LED22.DI
N$17
  Top 0.406: LED22.DO 59,57 61,55 65,55 LED23.DI
N$18
  Top 0.406: LED23.DO 69,57 71,55 75,55 LED24.DI
N$19
  Top 0.406: LED25.DO 77,47 77,45 65,45 LED26.DI
N$20
  Top 0.406: LED26.DO 67,47 67,49 55,49 LED27.DI
N$21
  Top 0.406: LED27.DO 57,47 57,45 45,45 LED28.DI
N$22
  Top 0.406: LED29.DO 37,47 37,45 25,45 LED30.DI
N$23
  Top 0.406: LED30.DO 27,47 27,49 15,49 LED31.DI
N$24
  Top 0.406: LED31.DO 17,47 17,45 5,45 LED32.DI
N$26
  Top 0.406: LED4.DO 39,77 41,75 45,75 LED5.DI
N$27
  Top 0.406: LED16.DO 6.7,69 2,69 2,59 5,59 LED17.DI
N$28
  Top 0.406: LED33.DO 9,37 11,35 15,35 LED34.DI
N$29
  Top 0.406: LED34.DO 19,37 21,35 25,35 LED35.DI
N$30
  Top 0.406: LED35.DO 29,37 31,35 35,35 LED36.DI
N$31
  Top 0.406: LED37.DO 49,37 51,35 55,35 LED38.DI
N$32
  Top 0.406: LED38.DO 59,37 61,35 65,35 LED39.DI
N$33
  Top 0.406: LED39.DO 69,37 71,35 75,35 LED40.DI
N$34
  Top 0.406: LED41.DO 77,27 77,25 65,25 LED42.DI
N$35
  Top 0.406: LED42.DO 67,27 67,29 55,29 LED43.DI
N$36
  Top 0.406: LED43.DO 57,27 57,25 45,25 LED44.DI
N$37
  Top 0.406: LED45.DO 37,27 37,25 25,25 LED46.DI
N$38
  Top 0.406: LED46.DO 27,27 27,29 15,29 LED47.DI
N$39
  Top 0.406: LED47.DO 17,27 17,25 5,25 LED48.DI
N$40
  Top 0.406: LED49.DO 9,17 11,15 15,15 LED50.DI
N$41
  Top 0.406: LED50.DO 19,17 21,15 25,15 LED51.DI
N$42
  Top 0.406: LED51.DO 29,17 31,15 35,15 LED52.DI
N$43
  Top 0.406: LED53.DO 49,17 51,15 55,15 LED54.DI
N$44
  Top 0.406: LED54.DO 59,17 61,15 65,15 LED55.DI
N$45
  Top 0.406: LED55.DO 69,17 71,15 75,15 LED56.DI
N$46
  Top 0.406: LED57.DO 77,7 77,5 65,5 LED58.DI
N$47
  Top 0.406: LED58.DO 67,7 67,9 55,9 LED59.DI
N$48
  Top 0.406: LED59.DO 57,7 57,5 45,5 LED60.DI
N$49
  Top 0.406: LED61.DO 37,7 37,5 25,5 LED62.DI
N$50
  Top 0.406: LED62.DO 27,7 27,9 15,9 LED63.DI
N$51
  Top 0.406: LED63.DO 17,7 17,5 5,5 LED64.DI
N$52
  Top 0.406: LED12.DO 46.7,68.85 35.1,68.85 35.1,67 LED13.DI
N$53
  Top 0.406: LED20.DO 39,57 41,55 45,55 LED21.DI
N$54
  Top 0.406: LED44.DO 47,27 47,29 35,29 LED45.DI
N$55
  Top 0.406: LED52.DO 39,17 41,15 45,15 LED53.DI
N$56
  Top 0.406: LED28.DO 47,47 47,49 35,49 LED29.DI
N$57
  Top 0.406: LED8.DO 78,77 78,69 75,69 LED9.DI
N$58
  Top 0.406: LED40.DO 78,37 78,29 75,29 LED41.DI
N$59
  Top 0.406: LED24.DO 78,57 78,49 75,49 LED25.DI
N$60
  Top 0.406: LED36.DO 39,37 41,35 45,35 LED37.DI
N$61
  Top 0.406: LED60.DO 47,7 47,9 35,9 LED61.DI
N$62
  Top 0.406: LED48.DO 7,27 7,29 2,29 2,19 5,19 LED49.DI
N$63
  Top 0.406: LED56.DO 78,17 78,9 75,9 LED57.DI
VDD  (via drill 0.5 pad 0.25, 0.6)  (1 unrouted)
  Top 0.406: v22,47 LED30.VDD | v20,43 22,43 22,46 | v27,41 25,41 LED30.LEDVDD | LED1.VDD 3,77 v2,76 | v12,77 LED2.VDD | v22,77 LED3.VDD | v32,77 LED4.VDD | v42,77 LED5.VDD | LED6.VDD v52,77 | LED7.VDD v62,77 | LED8.VDD v72,77 | LED16.VDD 3.3,65.7 v3.5,65.5 | 4,65 5,64 LED16.LEDVDD 5,62.5 v3.5,61 | v2.5,57 LED17.VDD | LED15.VDD v12,67 | LED14.VDD v22,67 | LED13.VDD v32,67 | LED12.VDD v42,67 | LED11.VDD v52,67 | LED10.VDD v62,67 | LED9.VDD v72,67 | LED9.LEDVDD 75,61.5 71,61.5 | 71,61.5 71,61 | 71,61.5 v71,63 | LED24.VDD v72,57 | LED23.VDD v62,57 | LED22.VDD v52,57 | LED21.VDD v42,57 | LED20.VDD v32,57 | LED19.VDD v22,57 | LED18.VDD v12,57 | LED32.VDD 3.3,45.7 v3.5,45.5 5,44 LED32.LEDVDD | LED31.VDD v12,47 | LED33.VDD v2,37 | LED34.VDD 13.5,37 v13.5,39 | LED35.VDD 22,37 v22,36.5 | LED36.VDD v32,37 | LED37.VDD v42,37 | LED38.VDD v52,37 | LED39.VDD v62,37 | LED40.VDD 73.5,37 v73.5,39 | LED27.LEDVDD C68.A 56,41.4 56,41 v56.5,41 v58.5,41 | LED28.VDD v42,47 | LED27.VDD v52,47 | LED26.VDD v62,47 | LED29.VDD v32,47 | LED46.VDD v22,27 | LED47.VDD v12,27 | LED48.VDD 3.5,27 v3.5,25.5 5,24 LED48.LEDVDD | LED45.VDD v32,27 | LED44.VDD v42,27 | LED43.VDD v52,27 | LED42.VDD v62,27 | LED41.VDD v72,27 | LED49.VDD v2,17 | LED50.VDD v12,17 | LED51.VDD v22,17 | LED52.VDD v32,17 | LED53.VDD v42,17 | LED54.VDD v52,17 | LED55.VDD v62,17 | LED56.VDD v72,17 | LED64.VDD v2,7 | LED62.VDD v22,7 | LED61.VDD v32,7 | LED59.VDD v52,7 | LED58.VDD v62,7 | LED57.VDD v72,7 | LED60.VDD v42,7 | LED63.VDD v12,7 | v45,21 LED44.LEDVDD
  Bottom 0.406: C32.1 22,45.85 v22,47 | 11,46.35 JP3.1 JP3.2 10,44 9,44 9,46 | 11.5,46.35 15,46.35 C35.1 | C33.A v20,43 | C67.A 27,41.4 v27,41 | v2,76 4.85,76 C1.1 | C2.1 13.15,75.85 v12,77 | C5.1 23.15,75.85 v22,77 | C6.1 33.15,75.85 v32,77 | C7.1 43.15,75.85 v42,77 | v52,77 55,77 C8.1 | v62,77 65,77 C9.1 | v72,77 75,77 C10.1 | v3.5,65.5 4.65,65.5 C18.1 | C19.1 2.5,55.85 v2.5,57 2.5,60.5 3.5,60.5 v3.5,61 | v12,67 15,67 C17.1 | v22,67 25,67 C16.1 | v32,67 35,67 C15.1 | v42,67 45,67 C14.1 | v52,67 55,67 C13.1 | v62,67 65,67 C12.1 | C11.1 75,67 v72,67 71,67 v71,63 | v72,57 75,57 C26.1 | v62,57 65,57 C25.1 | v52,57 55,57 C24.1 | v42,57 45,57 C23.1 | v32,57 35,57 C22.1 | v22,57 25,57 C21.1 | v12,57 15,57 C20.1 | v19.5,70.5 v19.5,67.5 | v39.5,70.5 v39.5,67.5 | v18.5,58.5 v18.5,55.5 | v28.5,58.5 v28.5,55.5 | v8.5,58.5 v8.5,55.5 | v9.5,66.5 v9.5,63.5 | v38.5,58.5 v38.5,55.5 | v48.5,58.5 v48.5,55.5 | v20.5,77.5 v18.5,75.5 | v30.5,77.5 v28.5,75.5 | v40.5,77.5 v38.5,75.5 | v50.5,77.5 v48.5,75.5 | v60.5,77.5 v58.5,75.5 | v70.5,77.5 v68.5,75.5 | v3.5,45.5 4.65,45.5 C36.1 | v19,50.5 v19,47.5 | v30,46.5 v30,43.5 | v39,50.5 v39,47.5 | v12,47 12,46.85 11.5,46.35 | v2,37 5,37 C37.1 | v13.5,39 15,39 C38.1 | v22,36.5 25,36.5 C39.1 | v32,37 35,37 C40.1 | v42,37 45,37 C41.1 | v52,37 55,37 C42.1 | v62,37 65,37 C43.1 | v73.5,39 75,39 C44.1 | v56.5,41 55,41 C68.A | C34.A 60,41 v58.5,41 | v42,47 45,47 C30.1 | v52,47 55,47 C29.1 | v62,47 65,47 C28.1 | JP1.5 JP1.6 v70,48 | 11,46.35 11,44 | 11.5,46.35 11,46.35 | 9,46.5 v9,49 | 10,46.5 v10,48 | 11,46.5 v11,49 11.3,49.3 IC1.5 | 69,44 v69,49 | 71,44 v71,49 71,45.85 C27.1 | v32,47 35,47 C31.1 | v28.5,35.5 v28.5,38.5 | v38.5,35.5 v38.5,38.5 | v48.5,35.5 v48.5,38.5 | v22,27 25,27 C50.1 | v12,27 15,27 C51.1
  Bottom 0.406: v3.5,25.5 5,25.5 C52.1 | v32,27 35,27 C49.1 | v42,27 45,27 C48.1 | v52,27 55,27 C47.1 | v62,27 65,27 C46.1 | v72,27 75,27 C45.1 | v10,23.5 v10,26.5 | v19,27.5 v19,30.5 | v30,23.5 v30,26.5 | v39,27.5 v39,30.5 | v50,23.5 v50,26.5 | v59,30.5 v59,27.5 | v70,23.5 v70,26.5 | v2,17 5,17 C53.1 | v12,17 15,17 C54.1 | v22,17 25,17 C55.1 | v32,17 35,17 C56.1 | v42,17 45,17 C57.1 | v52,17 55,17 C58.1 | v62,17 65,17 C59.1 | v72,17 75,17 C60.1 | v2,7 5,7 C3.1 | v22,7 25,7 C66.1 | v32,7 35,7 C65.1 | v52,7 55,7 C63.1 | v62,7 65,7 C62.1 | v72,7 75,7 C61.1 | v8.5,15.5 v8.5,18.5 | v18.5,15.5 v18.5,18.5 | v28.5,15.5 v28.5,18.5 | v38.5,15.5 v38.5,18.5 | v48.5,15.5 v48.5,18.5 | v58.5,15.5 v58.5,18.5 | v68.5,15.5 v68.5,18.5 | v10,3.5 v10,6.5 | v19,7.5 v19,10.5 | v30,3.5 v30,6.5 | v42,7 45,7 C64.1 | v39,7.5 v39,10.5 | v50,3.5 v50,6.5 | v59,7.5 v59,10.5 | v70,3.5 v70,6.5 | v12,7 15,7 C4.1 | IC2.5 44.95,21.05 v45,21 | v50,46.5 v50,43.5 | v59,50.5 v59,47.5 | v58.5,55.5 v58.5,58.5 | v68.5,58.5 v68.5,55.5 | v29.5,66.5 v29.5,63.5 | v50,63.5 v50,66.5 | v59,67.5 v59,70.5 | v69.5,63.5 v69.5,66
  pour Top: 0,0 80,0 80,80 0,80

### Text on the board
bStop: B 10/96 - 09/13/13 / R 10/96 - 11/23/13
_bsilk: Shannon / Strutz